# EAGLE design LTC3105 Breakout (EAGLE 6.4)
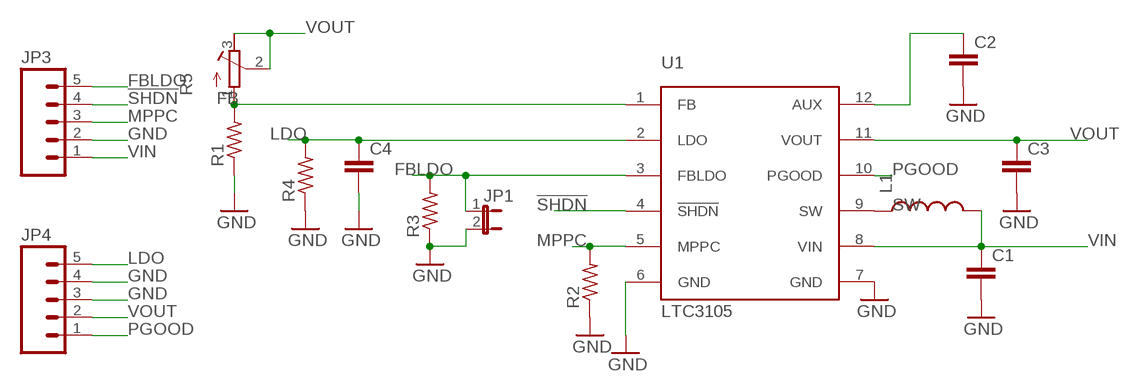
[diagram p0: schematic, sheet 1]

## Parts
C1  C-EUC0805  [C0805]
C2  C-EUC0603  [C0603]
C3  C-EUC0805  [C0805]
C4  C-EUC0805  [C0805]
JP1  JUMPER-2SMD-NO  [SJ_2S-NO]
JP3  M05PTH  [1X05]
JP4  M05PTH  [1X05]
L1  INDUCTOR1210  [1210]
R1  R-US_R0603  [R0603]
R2  R-US_R0603  [R0603]
R3  R-US_R0603  [R0603]
R4  R-US_R0603  [R0603]
R5  R-TRIMM3314J  [RTRIM3314J]
U1  LTC3105  [MSOP]

## Nets
!SHDN: JP3.4 U1.4(!SHDN)
FB: R1.2 R5.1(E) U1.1(FB)
FBLDO: JP1.1 JP3.5 R3.2 U1.3(FBLDO)
GND: C1.2 C2.2 C3.2 C4.2 JP1.2 JP3.2 JP4.3 JP4.4 R1.1 R2.1 R3.1 R4.1 U1.6(GND) U1.7(GND)
LDO: C4.1 JP4.5 R4.2 U1.2(LDO)
MPPC: JP3.3 R2.2 U1.5(MPPC)
N$2: C2.1 U1.12(AUX)
PGOOD: JP4.1 U1.10(PGOOD)
SW: L1.1 U1.9(SW)
VIN: C1.1 JP3.1 L1.2 U1.8(VIN)
VOUT: C3.1 JP4.2 R5.2(S) R5.3(A) U1.11(VOUT)

## Library data of the parts
C1-C4 = resistor:C-EU: CAPACITOR, European symbol
JP1 = SparkFun-Passives:JUMPER-2: Jumper Basic 0.1" spaced jumper. Use with breakaway headers.
JP3 JP4 = SparkFun-Connectors:M05: Header 5 Standard 5-pin 0.1" header. Use with straight break away headers (SKU : PRT-00116), right angle break away headers (PRT-00553), swiss pins (PRT-00743), machine pins (PRT-00117), and female headers (PRT-00115). Molex polarized connector foot print use with SKU : PRT-08230 with associated crimp pins and housings.
L1 = SparkFun-Passives:INDUCTOR: Inductors Basic Inductor/Choke - 0603 and 1206. Footprints are not proven and vary greatly between part numbers.
R1-R4 = resistor:R-US_: RESISTOR, American symbol
R5 = resistor:R-TRIMM: Trimm resistor
U1 = LTC3105:LTC3105

## Board
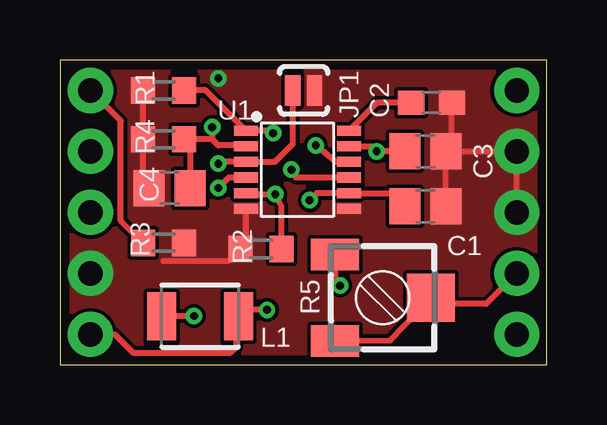
[diagram p1: board, top side]
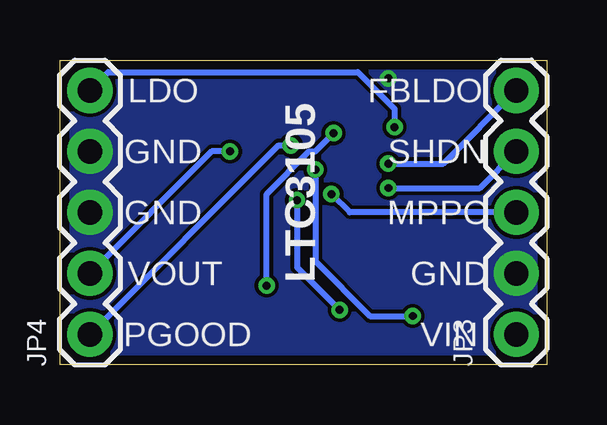
[diagram p2: board, bottom side, seen from below]

Size 20.3 x 12.7 mm. Coordinates in mm from the lower left corner, seen from the top.
Outline: 0,0 20.3,0 20.3,12.7 0,12.7 0,0
Copper layers (1*16): Top 0.0356mm / dielectric 1.5011mm / Bottom 0.0356mm
Design rules "LaenPCBOrder": minimum track width 6mil, minimum drill 13mil, track to track 6mil, track to pad 6mil, pad to pad 6mil, via to via 6mil, smd to smd 6mil, copper to edge 15mil, drill to drill 6mil, minimum pad ring 7mil, minimum via ring 7mil, stop-mask expansion 4mil, vias tented up to drill 13mil, thermal gap 10mil

### Footprints (pad centres in the part's own frame; a part is rotated, then mirrored left to right if it is on the bottom)
C0805 = smd 1.3 x 1.5: 1 -0.85,0; 2 0.85,0
C0603 = smd 1.1 x 1: 1 -0.85,0; 2 0.85,0
SJ_2S-NO = smd 0.635 x 1.27: 1 -0.45,0; 2 0.45,0
1X05 = drill 1.016 pad 1.88: 1 0,0; 2 2.54,0; 3 5.08,0; 4 7.62,0; 5 10.16,0
1210 = smd 1.2 x 2: 1 -1.6,0; 2 1.6,0
R0603 = smd 1 x 1.1: 1 -0.85,0; 2 0.85,0
RTRIM3314J = smd 1.3 x 2: 1 -1.8,-2; 3 1.8,-2 | smd 2 x 2: 2 0,2
MSOP = smd 1 x 0.42: 1 -2.15,1.625; 2 -2.15,0.975; 3 -2.15,0.325; 4 -2.15,-0.325; 5 -2.15,-0.975; 6 -2.15,-1.625; 7 2.15,-1.625; 8 2.15,-0.975; 9 2.15,-0.325; 10 2.15,0.325; 11 2.15,0.975; 12 2.15,1.625

### Placement (x,y rotation side)
C1  15.24,6.6 0 top
C2  15.49,10.92 0 top
C3  15.24,8.89 0 top
C4  4.57,7.37 180 top
JP1  10.16,11.43 0 top
JP3  1.27,1.27 90 bottom
JP4  19.05,1.27 90 bottom
L1  5.84,2.03 0 top
R1  4.32,11.43 0 top
R2  8.38,4.83 0 top
R3  4.32,5.08 180 top
R4  4.32,9.4 0 top
R5  13.46,2.79 270 top
U1  9.91,8.13 0 top

### Tracks (layer width: path | path; a pad name or v marks a point on that pad's centre or on a via)
!SHDN  (via drill 0.33)
  Top 0.254: U1.4 7.04,7.8 v6.6,7.37
  Bottom 0.254: v6.6,7.37 2.79,7.37 JP3.4
FB  (via drill 0.33)
  Top 0.254: R1.2 6.08,11.43 U1.1 8.79,9.75 v8.89,9.65 | R5.1 11.46,3.52 v11.68,3.3
  Bottom 0.254: v11.68,3.3 11.68,7.11 9.91,8.89 9.65,8.89 v8.89,9.65
FBLDO  (via drill 0.33)
  Top 0.254: v6.6,8.38 6.67,8.45 U1.3 8.96,8.45 9.71,9.2 JP1.1 | R3.2 2.54,6.01 2.54,10.16 JP3.5
  Bottom 0.254: v6.6,8.38 4.32,8.38 JP3.5
GND  (via drill 0.33)
  Top 0.254: U1.6 7.76,5.05 R2.1 7.02,4.32 4.32,4.32 | C4.2 3.47,7.62 R4.1 R1.1 | C3.2 JP4.4 JP4.3 | C1.2 C3.2 | C3.2 16.34,8.89 C2.2
  other vias: 6.6,11.94
  pour Top (no thermals): 0,0 0,12.7 20.32,12.7 20.32,0
  pour Bottom (no thermals): 0,0 0,12.7 20.32,12.7 20.32,0
LDO  (via drill 0.33)
  Top 0.254: U1.2 7.71,9.14 6.6,9.14 6.35,9.4 | 6.35,9.4 R4.2 5.42,9.14 C4.1 | v6.35,9.91 6.35,9.4
  Bottom 0.254: JP4.5 18.29,12.19 7.87,12.19 6.35,10.67 v6.35,9.91
MPPC  (via drill 0.33)
  Top 0.254: U1.5 7.8,7.11 v8.98,7.11 | v8.98,7.11 8.89,7.11 8.98,7.02 v8.98,7.11 | R2.2 9.23,6.6 v8.98,7.11
  Bottom 0.254: JP3.3 8.22,6.35 v8.98,7.11
N$2
  Top 0.254: C2.1 13.22,10.92 U1.12
PGOOD  (via drill 0.33)
  Top 0.254: v10.67,9.14 11.5,8.45 U1.10
  Bottom 0.254: JP4.1 11.18,9.14 v10.67,9.14
SW  (via drill 0.33)
  Top 0.254: U1.9 9.84,7.8 v9.65,8.13 | v5.59,2.03 L1.1
  Bottom 0.254: v9.65,8.13 9.65,4.32 7.37,2.03 v5.59,2.03
VIN  (via drill 0.33)
  Top 0.254: C1.1 14.39,7.15 U1.8 10.71,7.15 v10.41,6.86 | JP3.1 2.29,1.27 3.05,0.51 7.11,0.51 7.37,0.76 7.37,1.96 L1.2 7.7,2.29 v8.64,2.29
  Bottom 0.254: v10.41,6.86 10.41,4.06 v8.64,2.29
VOUT  (via drill 0.33)
  Top 0.254: R5.3 13.77,1.02 R5.2 15.24,2.79 14.99,2.54 17.78,2.54 JP4.2 | 14.39,9.1 C3.1 v13.21,8.89 12.99,9.1 U1.11
  Bottom 0.254: v13.21,8.89 13.97,8.89 JP4.2

### Text on the board
bPlace: FBLDO | LTC3105 | LDO | SHDN | GND | MPPC | GND | GND | VOUT | VIN | PGOOD